# Altium schematic sheet [Module]PS6W_24233_ISO.SchDoc: AC
size A4; Author: Nguyen Huu Nghia; CompanyName: MAT; Organization: AD20; Address1: x; Address2: x; Address3: x; Address4: x; DocumentNumber: 1; Revision: V1.0; SheetNumber: 1; SheetTotal: 1
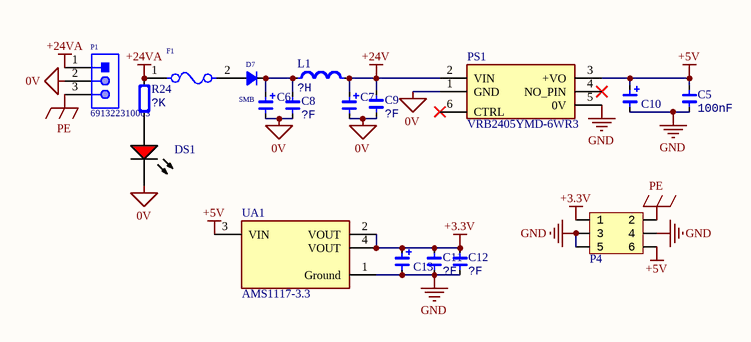
[diagram p0: [Module]PS6W_24233_ISO.SchDoc]

## Parts
C5  value 100nF  [CAP-0805]  (hidden comment: Cap_0805)
C6  Cap_Alu_8.3mm  [CAP ALUM 8.3MM]  (value not drawn)
C7  Cap_Alu_8.3mm  [CAP ALUM 8.3MM]  (value not drawn)
C8  value ?F  [CAP-0805]  (hidden comment: Cap_0805)
C9  value ?F  [CAP-0805]  (hidden comment: Cap_0805)
C10  Cap_Alu_6.6mm  [CAP ALUM 6.6MM]  (value not drawn)
C11  value ?F  [CAP-0805]  (hidden comment: Cap_0805)
C12  value ?F  [CAP-0805]  (hidden comment: Cap_0805)
C13  Cap_Alu_6.6mm  [CAP ALUM 6.6MM]  (value not drawn)
D7  Type: SMB  [DO-214AA]  (hidden comment: NAME)
DS1  C503B-RAN-CY0B0AA2  [CREE-C503B-RAN]  (value not drawn)
F1  0451005.MRL  [FP-0451-MFG]  (value not drawn)
L1  value ?H  [INDP120120X80N]  (hidden comment: Inductor)
P1  691322310003  [691322310003]
P4  HDR2x3  [HDR2X3_2.54_180]  (value not drawn)
PS1  VRB2405YMD-6WR3  [VRB2405YMD6WR3]
R24  value ?K  [RES-1206]  (hidden comment: Res_1206)
UA1  AMS1117-3.3  [FP-AMS1117-IPC_C]

## Nets
0V: C6.2 C7.2 C8.1 C9.1 DS1.2(K) P1.2 PS1.1(GND)
+3.3V: C11.1 C12.1 C13.1 P4.1 UA1.2(VOUT) UA1.4(VOUT)
+5V: C5.2 C10.1 P4.6 PS1.3(+VO) UA1.3(VIN)
+24V: C7.1 C9.2 L1.2 PS1.2(VIN)
+24VA: F1.1 P1.1 R24.2
GND: C5.1 C10.2 C11.2 C12.2 C13.2 P4.3 P4.4 P4.5 PS1.5(0V) UA1.1(Ground)
PE: P1.3 P4.2
NetC6_1: C6.1 C8.2 D7.2(K) L1.1
NetD7_1: D7.1(A) F1.2
NetDS1_1: DS1.1(A) R24.1

Not connected (* = marked no-connect by the designer): PS1 4(NO_PIN)* 6(CTRL)*

## Notes on the sheet
- Title
- Size:
- Date:
- A4
- Number:
- Time:
- Revision:
- Sheet
- of
- File:

## Library data of the parts
C5 C8 C9 C11 C12 = Cap_0805: Capacitor; Manufacturer: *
C6 C7 = Cap_Alu_8.3mm: Capacitor Alunium; Value: ?F
C10 C13 = Cap_Alu_6.6mm: Capacitor Alunium; Value: ?F
D7 = Diode_SMB: Diode; Manufacturer: *; Specification: *; Note: *; Value: NAME
DS1 = CMP-2000-06058-1: Cree(R) 5-mm Red Round LED, 2.1 V, -40 to 100 degC, 2-Pin THD, RoHS, Ammo; Forward Current: 50mA; Product Depth (mm): 5.8mm; Power Dissipation: 130mW; Viewing Angle: 15°; Test Current (It): 20mA; Type: Uni-Color; Shape Type: Circular; Product Height (mm): 8.8mm; Luminous Intensity: 12000mcd; Main Category: StandardLED; Forward Voltage: 2.6V; Number of  Elements: 1; Dominant Wave Length: 624nm; Reverse Voltage: 5V; Mounting Technology: ThroughHole; Datasheet Version: 12/2014; Manufacturer URL: http://www.cree.com/; Packaging: AmmoPack; Operating Temperature Classification: Industrial; Package Description: 2-Pin Through Hole Device, Dia 5.8 mm, Pitch 2.54 mm; Package Reference: C503B-RAN; Product Length (mm): 5.8mm; Datasheet URL: http://www.cree.com/sitecore-modules/web/~/media/Files/Cree/LED-Components-and-Modules/HB/Data-Sheets/C503B-RAS-RAN-AAS-AAN-RBS-RBN-ABS-ABN-RCS-RCN-ACS-ACN-1079.pdf; Operating Temp Range: -40Cto100C; Manufacturer: Cree; Mounting: ThroughHole; Emitting Color: Red; Lens Dimensions: 5x5x7.8mm; Package Type: T-13/4; Pin Count: 2
F1 = CMP-2000-05653-2: FUSE BRD MNT 5A 125VAC/VDC 2SMD; Manufacturer: Littelfuse Inc; Fuse Blow Speed: Fast; Voltage Rating: 125V; Fuse Interrupt Ac Current: 50A; Value: 0.0125Ω; Fuse I2T: 5.566A2Sec; Device Class L3: unset; Temperature Range Low: -55°C; Height: 2.94mm; Category: Fuse; Fuse Current: 5A; Octopart: https://octopart.com/0451005.mrl-littelfuse-566389; Package: 0451; RoHS: TRUE; Manufacturer Part Number: 0451005.MRL; Mouser Description: Surface Mount Fuses 125V 5A; Device Class L2: Fuses; ComponentLink2URL: https://www.littelfuse.com/~/media/electronics/datasheets/fuses/littelfuse_fuse_451_453_datasheet.pdf.pdf; Temperature Range High: +125°C; Digikey Description: FUSE BRD MNT 5A 125VAC/VDC 2SMD; Device Class L1: Circuit Protection; Automotive: No; Fuse Interrupt Dc Current: 50A; Temperature: -55°C to +125°C; Max Fuse Dc Voltage: 125V; Resistance: 0.0125Ω; ComponentLink2Description: Datasheet; Max Fuse Ac Voltage: 125V; Lead Free: Yes
L1 = Inductor: SMD Inductor; Manufacturer: *
P1 = CMP-1502-01887-1: Serie 322 - 3.81mm Horizontal PCB Header WR-TBL, 3 pin; Manufacturer: Wurth Elektronik; Pin Number: 3; Gender: Male; Packaging: Box; Package Reference: 691322310003; Mounting Technology: THT; Pitch: 3.81mm; Publisher: WurthElektronik; Part Number: 691322310003; Operating Temperature: -40to105degC; Manufacturer URL: http://www.we-online.de; Datasheet URL: http://katalog.we-online.de/em/datasheet/6913223100xx.pdf
P4 = HDR2x3_2.54: Header
PS1 = VRB2405YMD-6WR3: Power Supply; Manufacturer_Name: Mornsun; Datasheet Link: https://4donline.ihs.com/images/VipMasterIC/IC/MNSN/MNSN-S-A0002525578/MNSN-S-A0002525578-1.pdf?hkey=EF798316E3902B6ED9A73243A3159BB0; Height: 12.2mm; Manufacturer_Part_Number: VRB2405YMD-6WR3
R24 = Res_1206: Resistor; Specification: ±1%; Manufacturer: *; Note: *
UA1 = CMP-209535-000001-1: LDO Voltage Regulators 1A, 3.3V; Manufacturer: Advanced Monolithic Systems; Dropout Voltage: 1.1V; Output Type: Fixed; Nominal Supply Current: 5mA; Max Power Dissipation: 1.2W; Max Supply Voltage: 15V; Number Of Outputs: 1; Standoff Height: 0.64mm; Max Junction Temp: +125°C; Height: 1.8mm; Package: AMS1117; Device Class L2: Power Management ICs; ComponentLink2Description: Datasheet; ComponentLink2URL: http://www.advanced-monolithic.com/pdf/ds1117.pdf; Category: IC; RoHS: TRUE; Automotive: No; Device Class L1: Integrated Circuits (ICs); Output Current: 1A; Device Class L3: Voltage Regulators - Linear; Temperature: -40°C to +125°C; Output Voltage: 3.3V; Manufacturer Part Number: AMS1117-3.3; Temperature Range Low: -40°C; Octopart: https://octopart.com/ams1117-3.3-advanced+monolithic+systems-25899300; Lead Free: Yes; Ipc Land Pattern Name: SOT229P700X180-4; Temperature Range High: +125°C